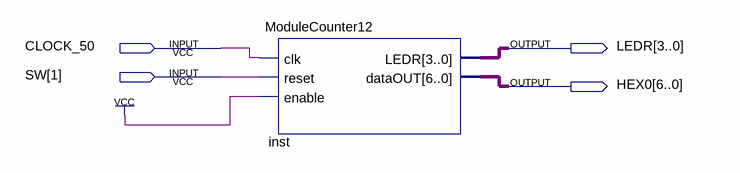
[diagram p0: schematic sheet]
// Quartus schematic Demo_ModuleCounter12.bdf as structural Verilog: 1 symbols, 4 pins
module Demo_ModuleCounter12 (
  input  CLOCK_50,
  input  [1:1] SW,
  output [3:0] LEDR,
  output [6:0] HEX0
);

  ModuleCounter12 inst (.clk(CLOCK_50), .reset(SW[1]), .enable(1'b1), .LEDR(LEDR), .dataOUT(HEX0));
endmodule
